# EAGLE schematic Tugas Day 0- Teresia Rosa Savera Putri (EAGLE 7.6.0)
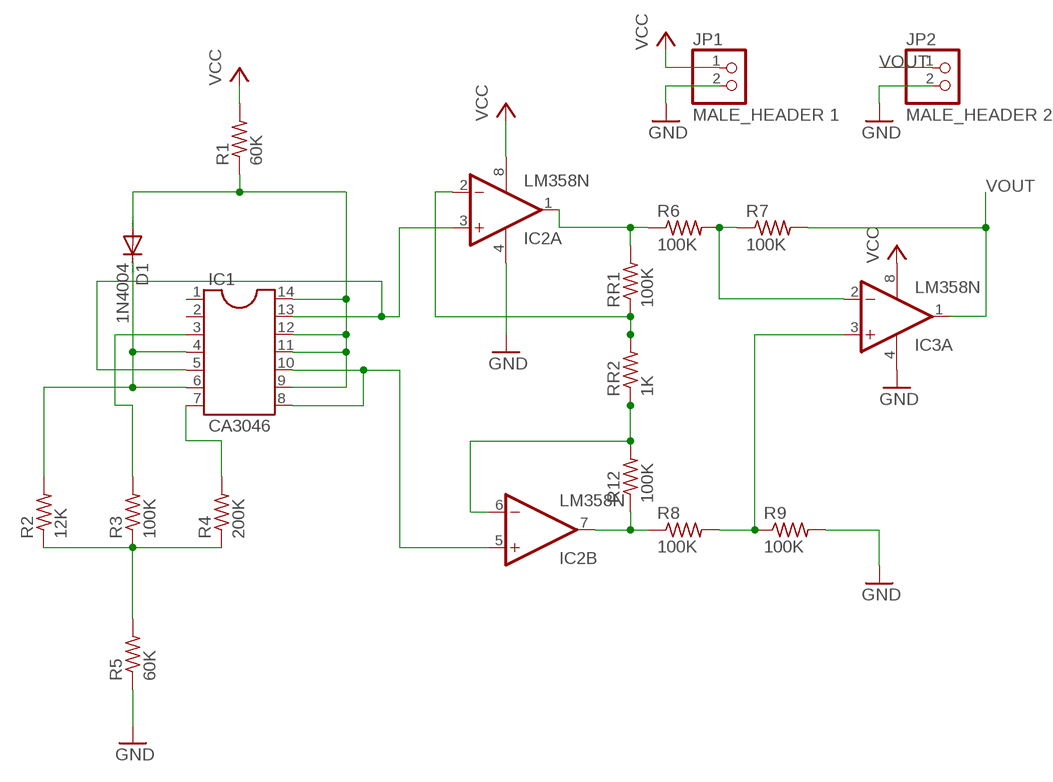
[diagram p0: schematic, sheet 1]

## Parts
D1  1N4004  [DO41-10]
IC1  CA3046  DIL14  [DIL14]
IC2  LM358N  [DIL08]
IC3  LM358N  [DIL08]
JP1  MALE_HEADER 1  PINHD-1X2  [1X02]
JP2  MALE_HEADER 2  PINHD-1X2  [1X02]
R1  60K  R-US_0204/7  [0204/7]
R2  12K  R-US_0204/7  [0204/7]
R3  100K  R-US_0204/7  [0204/7]
R4  200K  R-US_0204/7  [0204/7]
R5  60K  R-US_0204/7  [0204/7]
R6  100K  R-US_0204/7  [0204/7]
R7  100K  R-US_0204/7  [0204/7]
R8  100K  R-US_0204/7  [0204/7]
R9  100K  R-US_0204/7  [0204/7]
R12  100K  R-US_0204/7  [0204/7]
RR1  100K  R-US_0204/7  [0204/7]
RR2  1K  R-US_0204/7  [0204/7]

## Nets
GND: IC2.4(P:V-) IC3.4(P:V-) JP1.2 JP2.2 R5.1 R9.2
N$1: IC2.6(B:-IN) R12.2 RR2.1
N$2: IC2.7(B:OUT) R8.1 R12.1
N$4: D1.C IC1.4 IC1.6 R2.2
N$5: R2.1 R3.1 R4.1 R5.2
N$6: IC1.3 R3.2
N$7: IC1.7 R4.2
N$8: IC1.8 IC1.10 IC2.5(B:+IN)
N$9: IC2.2(A:-IN) RR1.1 RR2.2
N$10: IC1.5 IC1.13 IC2.3(A:+IN)
N$12: IC2.1(A:OUT) R6.1 RR1.2
N$13: IC3.3(A:+IN) R8.2 R9.1
N$14: IC3.2(A:-IN) R6.2 R7.1
N$16: D1.A IC1.9 IC1.11 IC1.12 IC1.14 R1.1
VCC: IC2.8(P:V+) IC3.8(P:V+) JP1.1 R1.2
VOUT: IC3.1(A:OUT) JP2.1 R7.2
Unconnected: IC1.1 IC1.2 IC3.5(B:+IN) IC3.6(B:-IN) IC3.7(B:OUT)

## Library data of the parts
D1 = diode:1N4004: DIODE general purpose rectifier, 1 A
IC1 = ic-package:DIL14: Dual In Line / Socket
IC2 IC3 = linear:LM358: OP AMP also LM158; LM258; LM2904 Source: http://cache.national.com/ds/LM/LM158.pdf
JP1 JP2 = pinhead:PINHD-1X2: PIN HEADER
R1-R9 R12 RR1 RR2 = rcl:R-US_: RESISTOR, American symbol